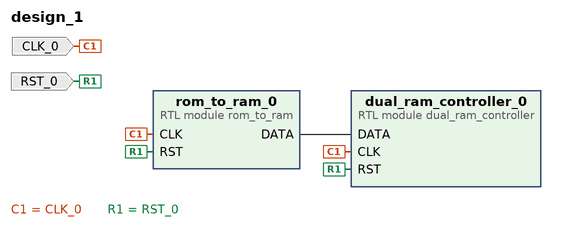
[diagram p0: block diagram of the top level]
# Vivado block design design_1, xc7a100tcsg324-1, Vivado 2024.2
create_bd_design design_1

create_bd_port -dir I -type rst RST_0
create_bd_port -dir I -type clk CLK_0

create_bd_cell -type module -reference rom_to_ram rom_to_ram_0
create_bd_cell -type module -reference dual_ram_controller dual_ram_controller_0

# ---- connections ----

connect_bd_net -net CLK_0_1 [get_bd_ports CLK_0] [get_bd_pins rom_to_ram_0/CLK] [get_bd_pins dual_ram_controller_0/CLK]
connect_bd_net -net RST_0_1 [get_bd_ports RST_0] [get_bd_pins rom_to_ram_0/RST] [get_bd_pins dual_ram_controller_0/RST]
connect_bd_net [get_bd_pins rom_to_ram_0/DATA] [get_bd_pins dual_ram_controller_0/DATA]

validate_bd_design
save_bd_design
